# EAGLE design actuator_board (EAGLE 9.6.2)
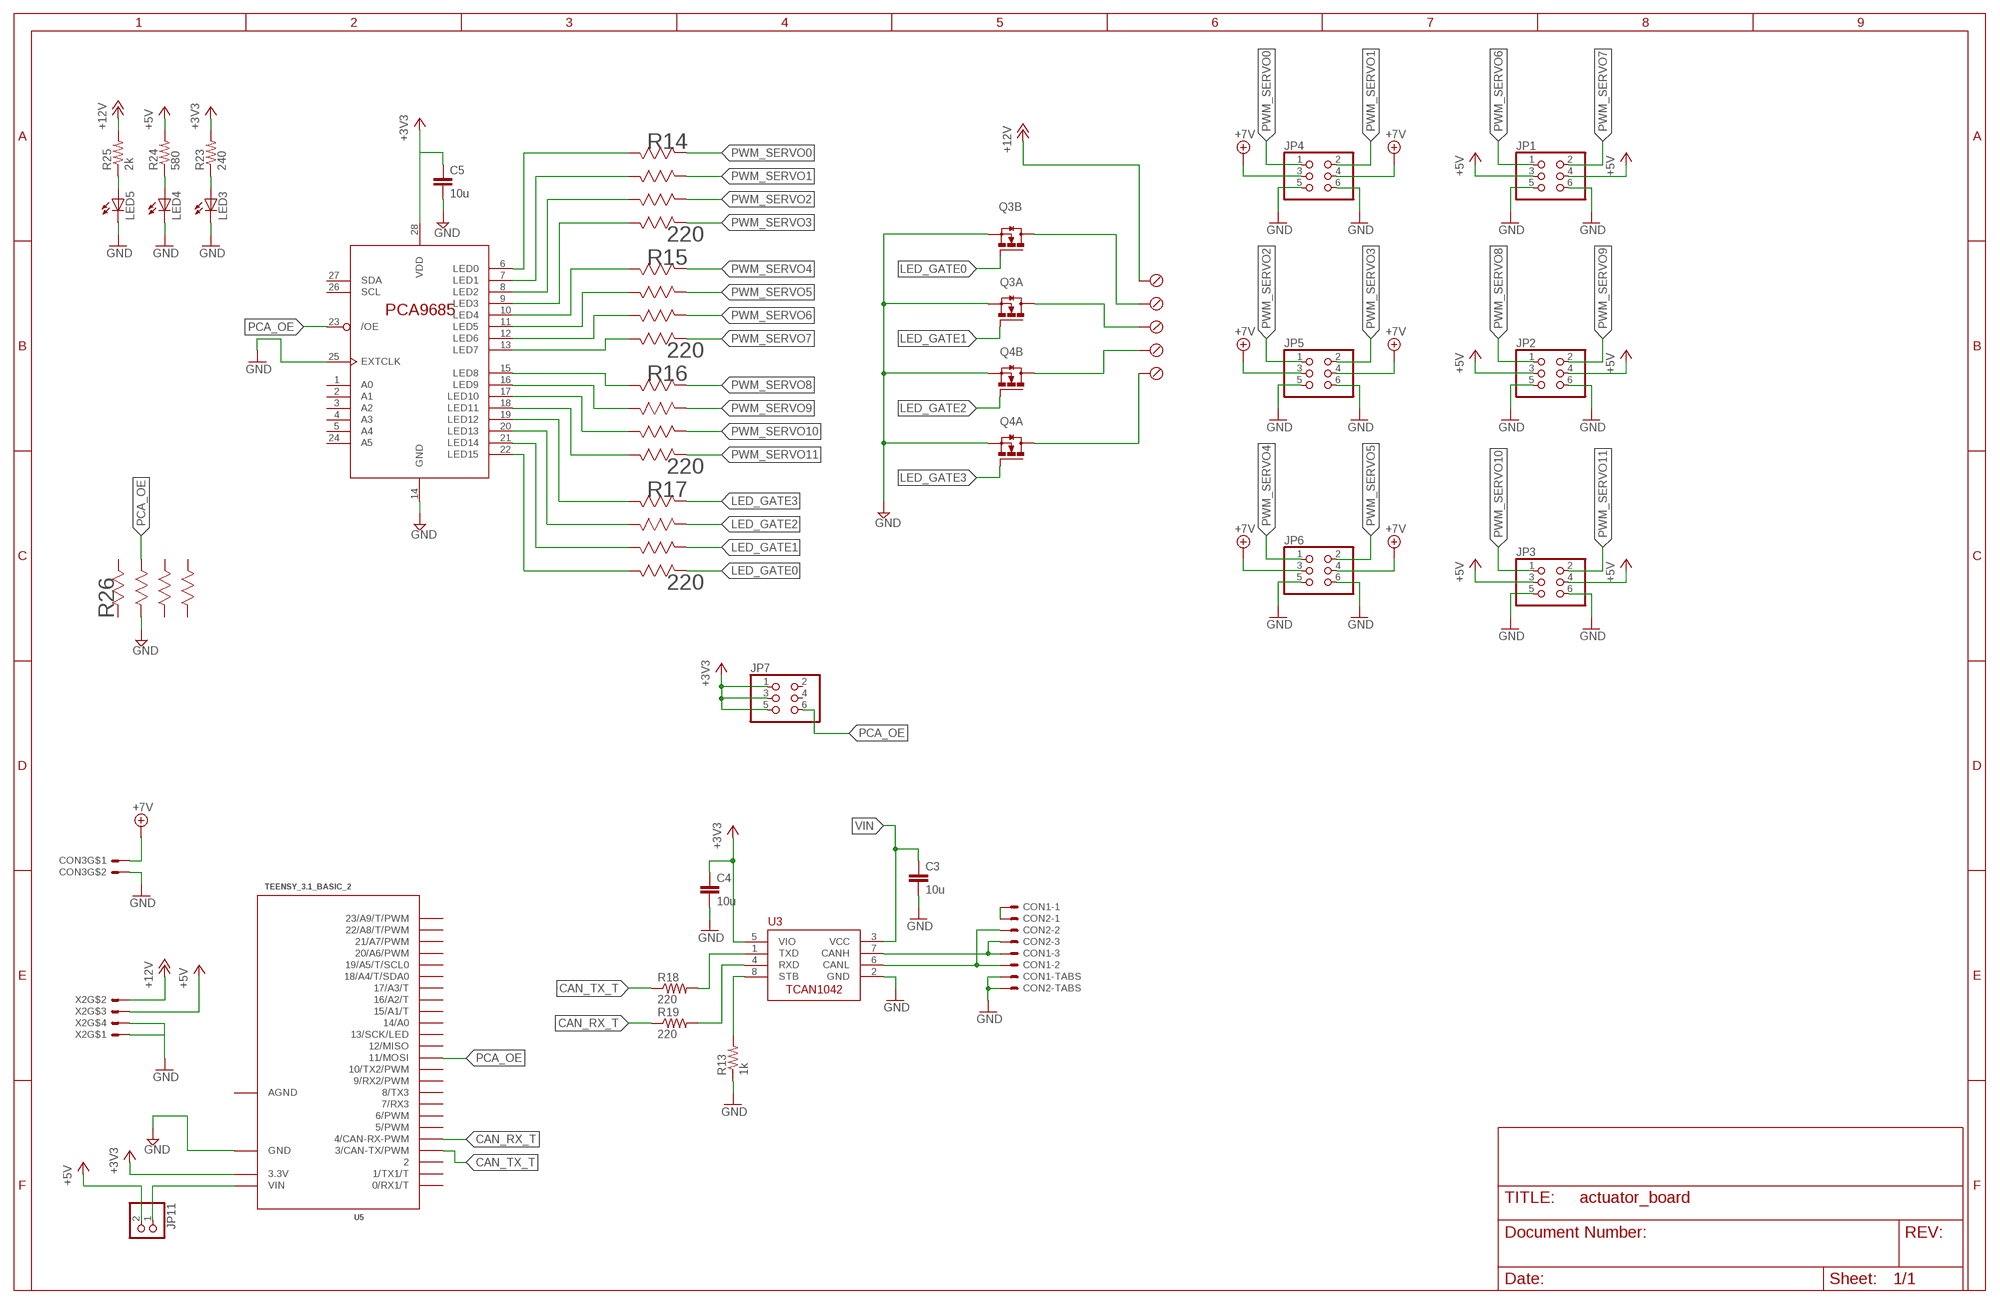
[diagram p0: schematic, sheet 1]

## Parts
C3  10u  C-EUC0805  [C0805]
C4  10u  C-EUC0805  [C0805]
C5  10u  C-EUC0805  [C0805]
CON1  SM03B-GHS-TB  [SM03B-GHS-TB]
CON2  SM03B-GHS-TB  [SM03B-GHS-TB]
CON3  MOLEX_5566-2  [5566-2]
JP1  PINHD-2X3  [2X03]
JP2  PINHD-2X3  [2X03]
JP3  PINHD-2X3  [2X03]
JP4  PINHD-2X3  [2X03]
JP5  PINHD-2X3  [2X03]
JP6  PINHD-2X3  [2X03]
JP7  PINHD-2X3  [2X03]
JP11  PINHD-1X2  [1X02]
LED3  LEDCHIPLED_1206  [CHIPLED_1206]
LED4  LEDCHIPLED_1206  [CHIPLED_1206]
LED5  LEDCHIPLED_1206  [CHIPLED_1206]
Q3  IRL6372TRPBF  [SO-8]
Q4  IRL6372TRPBF  [SO-8]
R13  1k  R-US_R0805  [R0805]
R14  220  EXB-V8V221JVEXBV8V-M  [EXBV8V-M]
R15  220  EXB-V8V221JVEXBV8V-M  [EXBV8V-M]
R16  220  EXB-V8V221JVEXBV8V-M  [EXBV8V-M]
R17  220  EXB-V8V221JVEXBV8V-M  [EXBV8V-M]
R18  220  R-US_R0805  [R0805]
R19  220  R-US_R0805  [R0805]
R23  240  R-US_R1206  [R1206]
R24  580  R-US_R1206  [R1206]
R25  2k  R-US_R1206  [R1206]
R26  10k  EXB-V8V221JVEXBV8V-M  [EXBV8V-M]
U3  TCAN1042HVDR  [SO-8]
U4  PCA9685PW  [TSSOP28]
U5  TEENSY_3.1_BASIC_2  [TEENSY_3.1_BASIC_2]
U$1  SCREWLESS_TERMINAL_HEADERSCREWLESS_TERMINAL_HEADER  [1989777_TERMINALHEADER]
X2  MOLEX_5566-4  [5566-4]

## Nets
+3V3: C4.1 C5.1 JP7.1 JP7.3 JP7.5 R23.2 U3.5(VIO) U4.28(VDD) U5.3.3V
+5V: JP1.3 JP1.4 JP2.3 JP2.4 JP3.3 JP3.4 JP11.2 R24.2 X2.3
+7V: CON3.1 JP4.3 JP4.4 JP5.3 JP5.4 JP6.3 JP6.4
+12V: R25.2 U$1.P$5(12+) X2.2
CAN_RX: R19.2 U3.4(RXD)
CAN_RX_T: R19.1 U5.4(4/CAN-RX-PWM)
CAN_TX1: R18.2 U3.1(TXD)
CAN_TX_T: R18.1 U5.3(3/CAN-TX/PWM)
CANH: CON1.P$3 CON2.P$3 U3.7(CANH)
CANL: CON1.P$2 CON2.P$2 U3.6(CANL)
CANSH: CON1.P$1 CON2.P$1
GND [net1]: C3.2 C4.2 C5.2 CON1.P$4 CON1.P$5 CON2.P$4 CON2.P$5 CON3.2 JP1.5 JP1.6 JP2.5 JP2.6 JP3.5 JP3.6 JP4.5 JP4.6 JP5.5 JP5.6 JP6.5 JP6.6 LED3.C LED4.C LED5.C Q3.1(B:S) Q3.3(A:S) Q4.1(B:S) Q4.3(A:S) R13.1 R26.2 U3.2(GND) U4.14(GND) U4.25(EXTCLK) U5.GND X2.1 X2.4
LED_DRAIN0: Q3.7(B:D) Q3.8(B:D) U$1.P$4(LED0)
LED_DRAIN1: Q3.5(A:D) Q3.6(A:D) U$1.P$3(LED1)
LED_DRAIN2: Q4.7(B:D) Q4.8(B:D) U$1.P$2(LED2)
LED_DRAIN3: Q4.5(A:D) Q4.6(A:D) U$1.P$1(LED3)
LED_GATE0: Q3.2(B:G) R17.4
LED_GATE1: Q3.4(A:G) R17.3
LED_GATE2: Q4.2(B:G) R17.2
LED_GATE3: Q4.4(A:G) R17.1
N$3: LED3.A R23.1
N$4: LED4.A R24.1
N$5: LED5.A R25.1
PCA_OE: JP7.6 R26.7 U4.23(/OE) U5.11(11/MOSI)
PWM_CH0: R14.8 U4.6(LED0)
PWM_CH1: R14.7 U4.7(LED1)
PWM_CH2: R14.6 U4.8(LED2)
PWM_CH3: R14.5 U4.9(LED3)
PWM_CH4: R15.8 U4.10(LED4)
PWM_CH5: R15.7 U4.11(LED5)
PWM_CH6: R15.6 U4.12(LED6)
PWM_CH7: R15.5 U4.13(LED7)
PWM_CH8: R16.8 U4.15(LED8)
PWM_CH9: R16.7 U4.16(LED9)
PWM_CH10: R16.6 U4.17(LED10)
PWM_CH11: R16.5 U4.18(LED11)
PWM_CH12: R17.8 U4.19(LED12)
PWM_CH13: R17.7 U4.20(LED13)
PWM_CH14: R17.6 U4.21(LED14)
PWM_CH15: R17.5 U4.22(LED15)
PWM_SERVO0: JP4.1 R14.1
PWM_SERVO1: JP4.2 R14.2
PWM_SERVO2: JP5.1 R14.3
PWM_SERVO3: JP5.2 R14.4
PWM_SERVO4: JP6.1 R15.1
PWM_SERVO5: JP6.2 R15.2
PWM_SERVO6: JP1.1 R15.3
PWM_SERVO7: JP1.2 R15.4
PWM_SERVO8: JP2.1 R16.1
PWM_SERVO9: JP2.2 R16.2
PWM_SERVO10: JP3.1 R16.3
PWM_SERVO11: JP3.2 R16.4
STB: R13.2 U3.8(STB)
VIN: C3.1 JP11.1 U3.3(VCC) U5.VIN
Unconnected: JP7.2 JP7.4 R26.1 R26.3 R26.4 R26.5 R26.6 R26.8 U4.1(A0) U4.2(A1) U4.3(A2) U4.4(A3) U4.5(A4) U4.24(A5) U4.26(SCL) U4.27(SDA) U5.0(0/RX1/T) U5.1(1/TX1/T) U5.2 U5.5(5/PWM) U5.6(6/PWM) U5.7(7/RX3) U5.8(8/TX3) U5.9(9/RX2/PWM) U5.10(10/TX2/PWM) U5.12(12/MISO) U5.13(13/SCK/LED) U5.14/A0 U5.15/A1(15/A1/T) U5.16/A2(16/A2/T) U5.17/A3(17/A3/T) U5.18/A4(18/A4/T/SDA0) U5.19/A5(19/A5/T/SCL0) U5.20/A6(20/A6/PWM) U5.21/A7(21/A7/PWM) U5.22/A8(22/A8/T/PWM) U5.23/A9(23/A9/T/PWM)

## Power pins joined to a net without a drawn wire
AGND: U5.AGND

## Library data of the parts
C3-C5 = rcl:C-EU: CAPACITOR, European symbol
CON1 CON2 = ARVP:SM03B-GHS-TB
CON3 = ARVP:MOLEX_5566-2
JP1-JP7 = pinhead:PINHD-2X3: PIN HEADER
JP11 = pinhead:PINHD-1X2: PIN HEADER
LED3-LED5 = led:LED: LED OSRAM: - CHIPLED LG R971, LG N971, LY N971, LG Q971, LY Q971, LO R971, LY R971 LH N974, LH R974 LS Q976, LO Q976, LY Q976 LO Q996 - Hyper CHIPLED LW Q18S LB Q993, LB Q99A, LB R99A - SideLED LS A670, LO A670, LY A670, LG A670, LP A670 LB A673, LV A673, LT A673, LW A673 LH A674 LY A675 LS A676, LA A676, LO A676, LY A676, LW A676 LS A679, LY A679, LG A679 - Hyper Micro SIDELED® LS Y876, LA Y876, LO Y876, LY Y876 LT Y87S - SmartLED LW L88C, LW L88S LB L89C, LB L89S, LG L890 LS L89K, LO L89K, LY L89K LS L896, LA L896, LO L896, LY L896 - TOPLED LS T670, LO T670, LY T670, LG T670, LP T670 LSG T670, LSP T670, LSY T670, LOP T670, LYG T670 LG T671, LOG T671, LSG T671 LB T673, LV T673, LT T673, LW T673 LH T674 LS T676, LA T676, LO T676, LY T676, LB T676, LH T676, LSB T676, LW T676 LB T67C, LV T67C, LT T67C, LS T67K, LO T67K, LY T67K, LW E67C LS E67B, LA E67B, LO E67B, LY E67B, LB E67C, LV E67C, LT E67C LW T67C LS T679, LY T679, LG T679 LS T770, LO T770, LY T770, LG T770, LP T770 LB T773, LV T773, LT T773, LW T773 LH T774 LS E675, LA E675, LY E675, LS T675 LS T776, LA T776, LO T776, LY T776, LB T776 LHGB T686 LT T68C, LB T68C - Hyper Mini TOPLED® LB M676 - Mini TOPLED Santana® LG M470 LS M47K, LO M47K, LY M47K Source: http://www.osram.convergy.de LUXEON: - LUMILED® LXK2-PW12-R00, LXK2-PW12-S00, LXK2-PW14-U00, LXK2-PW14-V00 LXK2-PM12-R00, LXK2-PM12-S00, LXK2-PM14-U00 LXK2-PE12-Q00, LXK2-PE12-R00, LXK2-PE12-S00, LXK2-PE14-T00, LXK2-PE14-U00 LXK2-PB12-K00, LXK2-PB12-L00, LXK2-PB12-M00, LXK2-PB14-N00, LXK2-PB14-P00, LXK2-PB14-Q00 LXK2-PR12-L00, LXK2-PR12-M00, LXK2-PR14-Q00, LXK2-PR14-R00 LXK2-PD12-Q00, LXK2-PD12-R00, LXK2-PD12-S00 LXK2-PH12-R00, LXK2-PH12-S00 LXK2-PL12-P00, LXK2-PL12-Q00, LXK2-PL12-R00 Source: www.luxeon.com KINGBRIGHT: KA-3528ASYC Source: www.kingbright.com
Q3 Q4 = dropper_torpedo_v3:IRL6372TRPBF
R13 R18 R19 R23-R25 = rcl:R-US_: RESISTOR, American symbol
R14-R17 R26 = ARVP:EXB-V8V221JV; MANUFACTURER_PART_NUMBER: EXBV8V221JV; VENDOR: Panasonic
U3 = ARVP:TCAN1042HVDR
U4 = dropper_torpedo_v3:PCA9685
U5 = Teensy_3_Series_Board_v1.0:TEENSY_3.1_BASIC_2: Footprint for Teensy 3.1 board using all pin connections on the outer perimeter
U$1 = Screwless-terminal-header:SCREWLESS_TERMINAL_HEADER
X2 = ARVP:MOLEX_5566-4

## Net classes
1 net1: clearance 0.203 mm to class 0

## Board
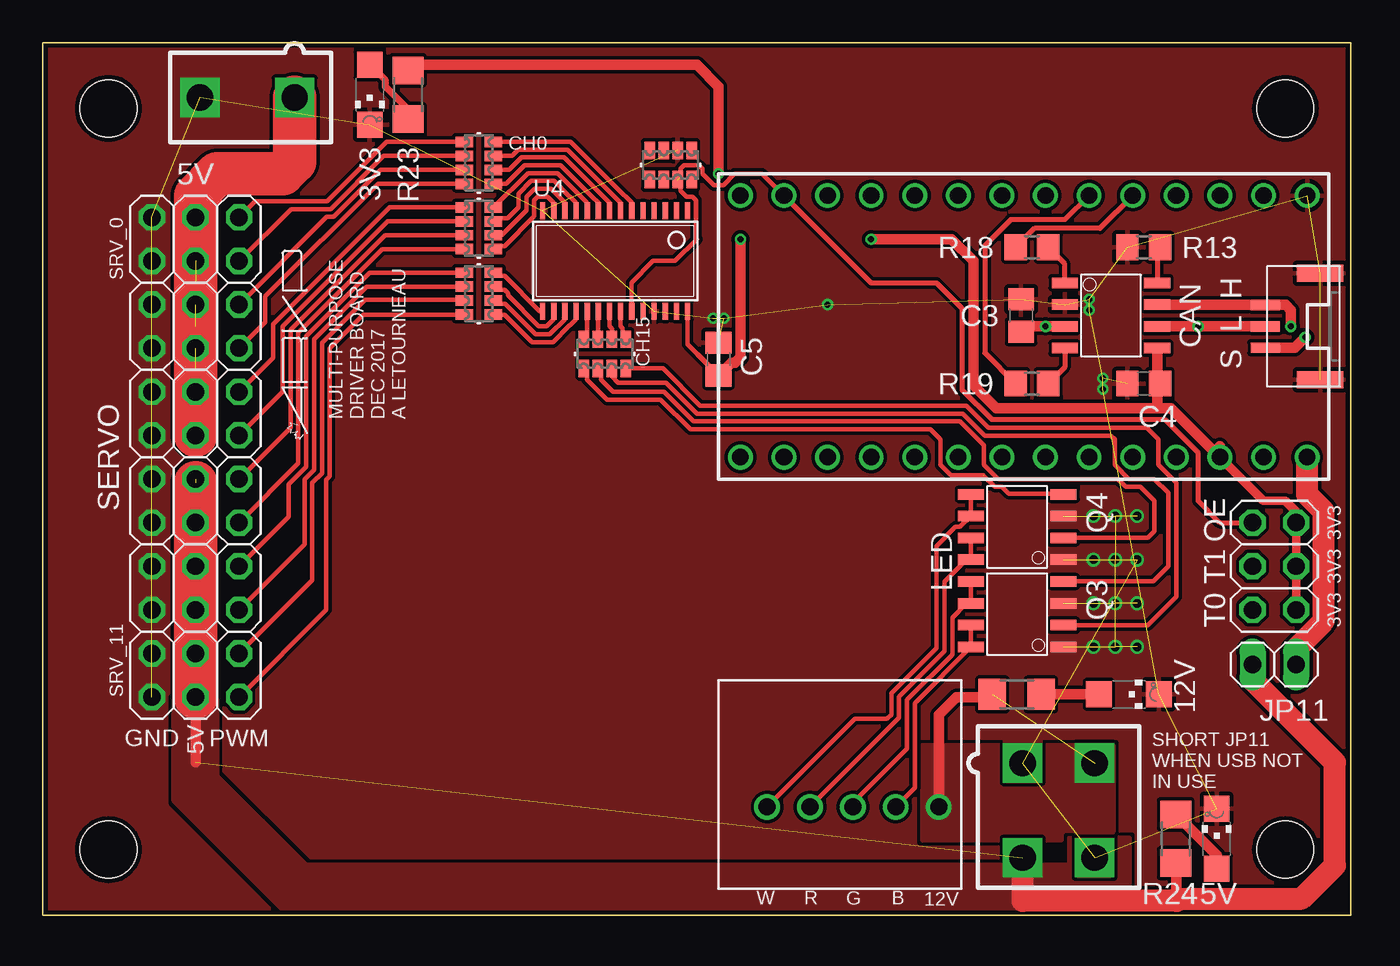
[diagram p1: board, top side]
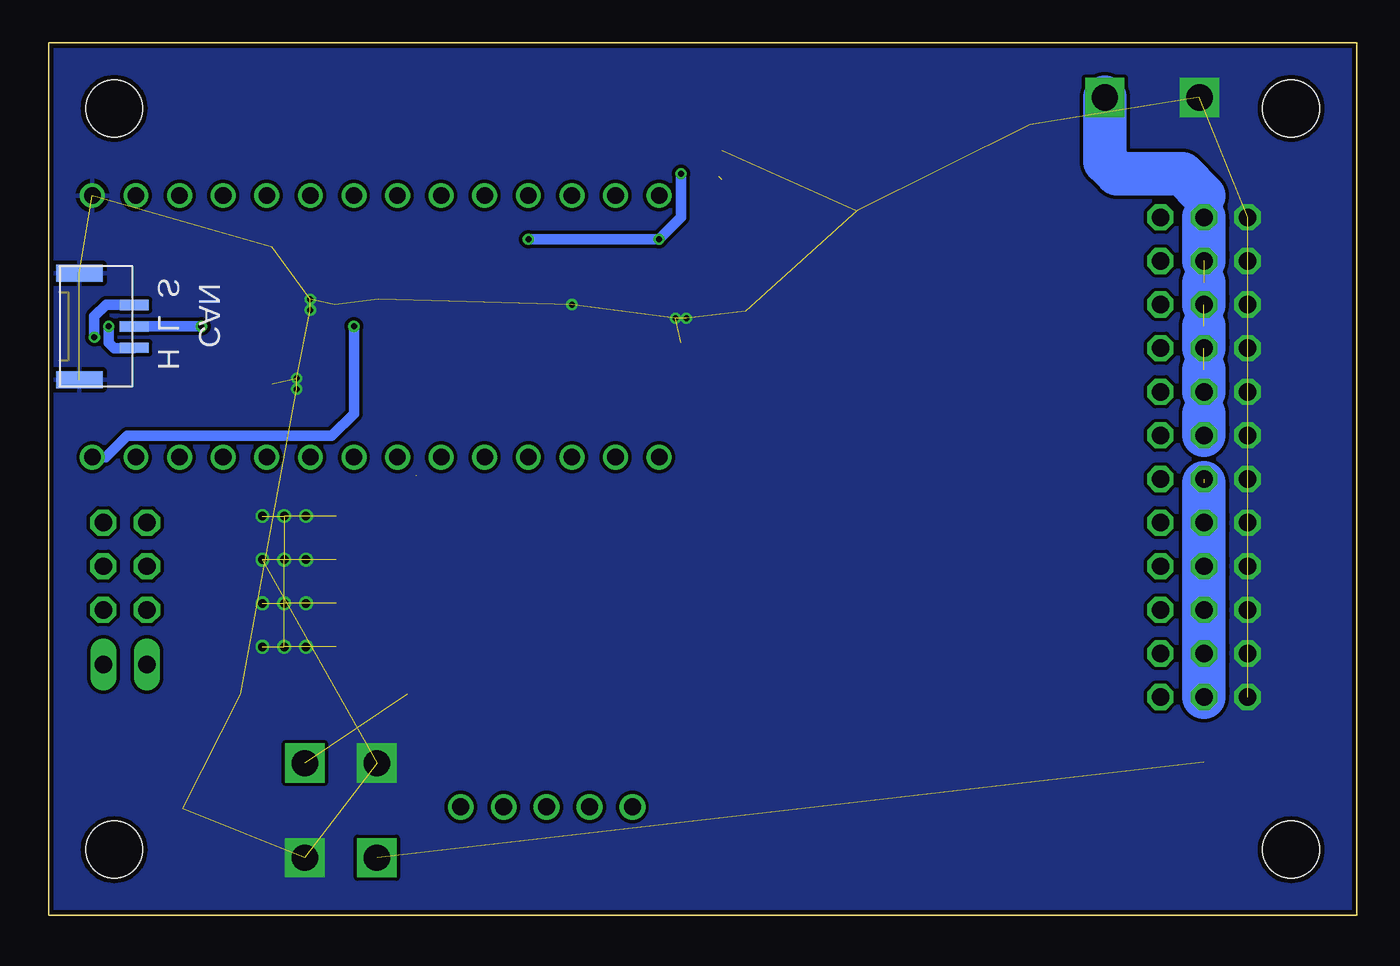
[diagram p2: board, bottom side, seen from below]

Size 76.2 x 50.8 mm. Coordinates in mm from the lower left corner, seen from the top.
Outline: 0,0 76.2,0 76.2,50.8 0,50.8 0,0
Copper layers (1*16): Top 0.035mm / dielectric 1.5mm / Bottom 0.035mm
Design rules "ITEADstudioDRC": minimum track width 6mil, minimum drill 12mil, track to track 8mil, track to pad 8mil, pad to pad 8mil, via to via 8mil, smd to smd 0mil, copper to edge 10mil, drill to drill 10mil, minimum pad ring 6mil, minimum via ring 6mil, stop-mask expansion 2mil, vias tented up to drill 100mil, thermal gap 10mil
Milling: 4 lines

### Footprints (pad centres in the part's own frame; a part is rotated, then mirrored left to right if it is on the bottom)
C0805 = smd 1.3 x 1.5: 1 -0.95,0; 2 0.95,0
SM03B-GHS-TB = smd 0.6 x 1.7: P$1 -1.25,0.85; P$2 0,0.85; P$3 1.25,0.85 | smd 1 x 2.7: P$4 -3.1,-2.35; P$5 3.1,-2.35
5566-2 = drill 1.524 square: 1 0,-2.756; 2 0,2.756
2X03 = drill 1.016 octagon: 1 -2.54,-1.27; 2 -2.54,1.27; 3 0,-1.27; 4 0,1.27; 5 2.54,-1.27; 6 2.54,1.27
1X02 = drill 1.016 long: 1 -1.27,0; 2 1.27,0
CHIPLED_1206 = smd 1.5 x 1.5: A 0,-1.75; C 0,1.75
SO-8 = smd 1.524 x 0.61: 1 -2.692,1.905; 2 -2.692,0.635; 3 -2.692,-0.635; 4 -2.692,-1.905; 5 2.692,-1.905; 6 2.692,-0.635; 7 2.692,0.635; 8 2.692,1.905
R0805 = smd 1.3 x 1.5: 1 -0.95,0; 2 0.95,0
EXBV8V-M = smd 1.016 x 0.61: 1 -0.851,1.219; 2 -0.851,0.406; 3 -0.851,-0.406; 4 -0.851,-1.219; 5 0.851,-1.219; 6 0.851,-0.406; 7 0.851,0.406; 8 0.851,1.219
R1206 = smd 1.6 x 1.803: 1 -1.422,0; 2 1.422,0
TSSOP28 = smd 0.305 x 0.991: 1 -4.225,-2.918; 2 -3.575,-2.918; 3 -2.925,-2.918; 4 -2.275,-2.918; 5 -1.625,-2.918; 6 -0.975,-2.918; 7 -0.325,-2.918; 8 0.325,-2.918; 9 0.975,-2.918; 10 1.625,-2.918; 11 2.275,-2.918; 12 2.925,-2.918; 13 3.575,-2.918; 14 4.225,-2.918; 15 4.225,2.918; 16 3.575,2.918; 17 2.925,2.918; 18 2.275,2.918; 19 1.625,2.918; 20 0.975,2.918; 21 0.325,2.918; 22 -0.325,2.918; 23 -0.975,2.918; 24 -1.625,2.918; 25 -2.275,2.918; 26 -2.925,2.918; 27 -3.575,2.918; 28 -4.225,2.918
TEENSY_3.1_BASIC_2 = drill 0.965: 0 -7.62,13.97; 1 -7.62,11.43; 2 -7.62,8.89; 3 -7.62,6.35; 3.3V 7.62,11.43; 4 -7.62,3.81; 5 -7.62,1.27; 6 -7.62,-1.27; 7 -7.62,-3.81; 8 -7.62,-6.35; 9 -7.62,-8.89; 10 -7.62,-11.43; 11 -7.62,-13.97; 12 -7.62,-16.51; 13 7.62,-16.51; 14/A0 7.62,-13.97; 15/A1 7.62,-11.43; 16/A2 7.62,-8.89; 17/A3 7.62,-6.35; 18/A4 7.62,-3.81; 19/A5 7.62,-1.27; 20/A6 7.62,1.27; 21/A7 7.62,3.81; 22/A8 7.62,6.35; 23/A9 7.62,8.89; AGND 7.62,13.97; GND -7.62,16.51; VIN 7.62,16.51
1989777_TERMINALHEADER = drill 0.991 pad 1.499: P$1 2.825,4.775; P$2 5.325,4.775; P$3 7.825,4.775; P$4 10.325,4.775; P$5 12.825,4.775
STAND-OFF = hole 3.302: 0,0
5566-4 = drill 1.524 square: 1 2.101,-2.756; 2 -2.101,-2.756; 3 2.101,2.756; 4 -2.101,2.756

### Placement (x,y rotation side)
C3  56.99,34.92 90 top
C4  64.14,30.96 180 top
C5  39.37,32.38 90 top
CON1  72.07,34.29 90 top
CON2  72.07,34.29 270 bottom
CON3  11.91,47.62 90 top
JP1  8.89,24.13 180 top
JP2  8.89,19.05 180 top
JP3  8.89,13.97 180 top
JP4  8.89,39.37 180 top
JP5  8.89,34.29 180 top
JP6  8.89,29.21 180 top
JP7  71.75,20.32 90 top
JP11  71.75,14.61 180 top
LED3  19.05,47.78 180 top
LED4  68.39,4.45 0 top
LED5  63.28,12.86 270 top
Q3  56.77,17.53 180 top
Q4  56.77,22.61 180 top
R13  64.14,38.89 0 top
R14  25.4,43.81 0 top
R15  25.4,40.01 0 top
R16  25.4,36.2 0 top
R17  32.74,32.69 90 top
R18  57.63,38.89 0 top
R19  57.63,30.96 0 top
R23  21.27,47.78 90 top
R24  66.01,4.45 270 top
R25  56.74,12.86 180 top
R26  36.58,43.69 270 top
U3  62.23,34.92 0 top
U4  33.34,38.1 180 top
U5  57.15,34.29 270 top
U$1  39.37,1.52 0 top
U$5  [LOGO3]  15.37,27.84 90 top
U$6  [LETTER_L]  -82.55,-72.39 0 top  (outside the outline)
U$7  [DOCFIELD]  64.77,-72.39 0 top  (outside the outline)
U$8  [STAND-OFF]  72.39,3.81 0 top
U$9  [STAND-OFF]  3.81,3.81 0 top
U$10  [STAND-OFF]  3.81,46.99 0 top
U$11  [STAND-OFF]  72.39,46.99 0 top
X2  59.18,6.1 180 top

### Tracks (layer width: path | path; a pad name or v marks a point on that pad's centre or on a via)
+3V3  (via drill 0.35)
  Top 0.152: R23.2 21.59,49.53 21.6,49.53
  Top 0.254: 38.16,32.64 37.56,33.24 U4.28
  Top 0.305: C5.1 38.16,32.64
  Top 0.508: U5.3.3V 71.12,24.13 72.39,24.13 73.03,23.5 JP7.5 JP7.3 JP7.1
  Top 0.61: 64.92,31.12 U3.5 | 64.92,31.12 C4.1 64.93,30.8 64.93,29.53 | 64.92,30.96 64.92,31.12 | 68.58,27.3 U5.3.3V 65.72,29.53 64.93,29.53 | C5.1 40.11,32.18 40.33,32.18 40.64,32.49 v40.64,39.37 | v39.37,43.18 39.37,48.26 38.1,49.53 36.83,49.53 21.59,49.53 | v48.26,39.37 52.95,39.37 54.22,38.1 54.22,30.87 55.56,29.53 64.93,29.53
  Bottom 0.61: v39.37,43.18 39.37,40.64 v40.64,39.37 v48.26,39.37
+5V  (2 unrouted)
  Top 0.152: 8.89,24.13 JP1.4 8.89,26.39
  Top 0.61: JP3.4 8.89,8.89 | R24.2 66.04,2.99 66.04,0.95 66.04,0.83
  Top 1.27: X2.3 57.08,0.83 66.04,0.83 | 66.04,0.95 73.34,0.95 75.27,2.88 75.27,8.89 70.48,13.68 JP11.2
  Top 2.54: JP3.4 JP3.3 JP2.4 JP2.3 JP1.4 8.89,25.2
  Bottom 2.54: JP3.3 8.89,16.51 | JP3.3 JP2.4 JP2.3 JP1.4 8.89,25.2 | 8.89,13.97 JP3.4 JP3.3
  pour Top (no thermals): 59.82,4.51 59.82,2.92 15.34,2.92 10.16,8.1 10.16,12.54 10,12.7 7.78,12.7 7.62,12.54 7.62,6.67 13.97,0.32 63.31,0.32 63.31,4.51
+7V  (3 unrouted)
  Top 0.152: 8.89,26.95 JP6.4
  Top 2.54: CON3.1 14.66,43.87 13.97,43.18 10.16,43.18 8.89,41.91 JP4.3 JP6.4
  Bottom 2.54: JP5.3 8.89,36.83 | JP5.4 8.89,34.29 | JP6.4 8.89,29.21 | JP6.3 8.89,31.75 | 8.89,41.91 10.16,43.18 13.97,43.18 14.61,43.81 | 14.61,43.81 14.61,44.13 | 14.61,43.81 14.66,43.87 CON3.1 | JP4.4 JP4.3
+12V  (1 unrouted)
  Top 0.61: R25.2 55.16,12.7 53.21,12.7 52.2,11.68 U$1.P$5
  pour Top (rank 2, no thermals): 62.36,9.91 62.36,4.83 59.34,4.83 59.34,4.35 51.24,4.35 51.24,9.91
CAN_RX
  Top 0.305: U3.4 59.54,31.92 R19.2
CAN_RX_T
  Top 0.305: U5.4 59.56,40.51 56.39,40.51 54.88,39 54.88,32.75 R19.1
CAN_TX1
  Top 0.305: U3.1 59.54,37.93 R18.2
CAN_TX_T
  Top 0.305: U5.3 61.59,40 57.78,40 57.57,39.79 R18.1
CANH  (via drill 0.35)
  Top 0.61: U3.7 71.2,35.56 CON1.P$3 72.41,35.54 72.71,35.24 v72.71,34.29
  Bottom 0.61: v72.71,34.29 72.71,33.34 72.39,33.02 71.24,33.02 CON2.P$3
CANL  (via drill 0.35)
  Top 0.61: U3.6 v67.31,34.29 CON2.P$2
  Bottom 0.61: CON2.P$2 v67.31,34.29
CANSH  (via drill 0.35)
  Top 0.61: CON1.P$1 72.93,33.04 v73.54,33.66
  Bottom 0.61: v73.54,33.66 73.54,34.88 72.87,35.56 71.24,35.56 CON2.P$1
GND  (via drill 0.35, 0.5)  (53 unrouted)
  other vias: 62.48,23.24 61.21,23.24 62.48,20.7 61.21,20.7 62.48,18.16 61.21,18.16 62.48,15.62 61.21,15.62 63.75,23.24 63.75,20.7 63.75,18.16 63.75,15.62 61.75,31.27 61.75,30.64 60.96,35.88 60.96,35.24 39.05,34.77 39.69,34.77 45.72,35.56
  pour Bottom (rank 3, no thermals): 55.69,10.38 55.69,1.81 62.67,1.81 62.67,10.38
  pour Top (no thermals): 58.52,23.88 64.39,23.88 64.39,22.61 58.52,22.61
  pour Top (no thermals): 58.36,21.34 64.39,21.34 64.39,20.07 58.36,20.07
  pour Top (no thermals): 58.52,18.8 64.39,18.8 64.39,17.53 58.52,17.53
  pour Top (no thermals): 58.52,16.26 64.39,16.26 64.39,14.99 58.52,14.99
  pour Bottom (no thermals): 5.08,41.91 7.62,41.91 7.62,11.43 5.08,11.43
  pour Top (rank 3, no thermals): 55.53,10.38 55.53,1.49 62.04,1.46 62.67,10.38
  pour Top (rank 2, no thermals): 5.08,41.91 7.62,41.91 7.62,11.43 5.08,11.43
  pour Top (no thermals): 11.27,46.2 11.27,49.05 7.14,49.05 7.14,46.2
  pour Bottom (no thermals): 11.27,46.2 11.27,49.05 7.14,49.05 7.14,46.2
  pour Bottom (rank 2): 0.32,0.32 75.88,0.32 75.88,50.48 0.32,50.48
  pour Top (rank 3): 0.32,0.32 75.88,0.32 75.88,50.48 0.32,50.48
LED_DRAIN0
  Top 0.254: Q3.7 Q3.8 50.8,12.34 50.8,7.4 U$1.P$4
LED_DRAIN1
  Top 0.254: Q3.5 Q3.6 53.81,18.16 52.98,17.33 52.98,15.18 50.34,12.53 50.34,9.7 47.2,6.55 U$1.P$3
LED_DRAIN2
  Top 0.254: Q4.7 Q4.8 53.81,20.7 52.53,19.41 52.53,15.37 49.89,12.72 49.89,11.49 U$1.P$2
LED_DRAIN3
  Top 0.254: Q4.5 Q4.6 53.44,22.61 53.18,22.61 52.07,21.5 52.07,15.55 49.43,12.91 49.43,11.68 49.18,11.43 47.33,11.43 U$1.P$1
LED_GATE0
  Top 0.254: R17.4 36.12,31.84 38.29,29.67 53.81,29.67 55.09,28.38 64.33,28.38 64.99,27.72 64.99,26.23 66.04,25.18 66.04,18.54 64.39,16.89 Q3.2
LED_GATE1
  Top 0.254: R17.3 33.15,31.37 33.52,31 36.31,31 38.1,29.21 53.62,29.21 54.9,27.93 62.23,27.93 62.45,27.71 62.45,26.23 63.28,25.4 64.77,25.4 65.58,24.59 65.58,20.32 64.69,19.43 Q3.4
LED_GATE2
  Top 0.254: R17.2 32.51,31.66 32.51,31.19 33.23,30.48 36.18,30.48 37.91,28.75 53.43,28.75 54.83,27.35 54.83,26.23 55.66,25.4 62.63,25.4 63.07,24.97 63.09,24.94 63.96,24.94 64.77,24.13 64.77,22.35 64.39,21.97 Q4.2
LED_GATE3  (1 unrouted)
  Top 0.254: Q4.4 59.54,24.59 59.59,24.54 56.29,24.54 55.88,24.94 55.47,24.94 54.81,25.6 | R17.1 31.7,31.66 31.7,31.19 32.87,30.02 35.99,30.02 37.72,28.3 51.71,28.3 52.29,27.72 52.29,26.23 52.9,25.62 54.8,25.62
N$3
  Top 0.406: LED3.A 19.96,48.62 19.96,48.24 21.27,46.93 R23.1
N$4
  Top 0.61: R24.1 68.39,3.49 LED4.A
N$5
  Top 0.61: R25.1 LED5.A
PCA_OE  (1 unrouted)
  Top 0.152: 39.37,42.52 39.32,42.57 39.12,42.57
  Top 0.254: U5.11 41.91,43.18 40.3,43.18 39.64,42.52 39.37,42.52 39.1,42.52 38.43,43.19 38.43,43.48 38.24,43.67 37.35,43.67 37.16,43.48 37.16,43.02 | U4.23 34.29,35.2 34.29,36.83 35.56,38.1 36.83,38.1 38.1,39.37 38.05,39.42 38.05,41.65 37.85,41.84 37.51,41.84 37.16,42.19 37.16,42.66 R26.7
  Top 0.305: U5.11 48.26,36.83 52.07,36.83 53.34,35.56 53.56,35.34 53.56,30.6 55.29,28.87 65.37,28.87 67.31,26.93 67.31,24.13 68.58,22.86 JP7.6
PWM_CH0
  Top 0.254: R14.8 27.49,45.03 27.5,45.04 30.74,45.04 33.49,42.3 34.31,41.48 U4.6
PWM_CH1
  Top 0.254: R14.7 27.32,44.22 27.69,44.59 30.55,44.59 33.3,41.84 33.66,41.48 U4.7
PWM_CH2
  Top 0.254: R14.6 27.16,43.41 27.88,44.13 30.36,44.13 32.19,42.3 33.01,41.48 U4.8
PWM_CH3
  Top 0.254: R14.5 26.99,42.6 28.07,43.67 30.17,43.67 32,41.84 32.36,41.48 U4.9
PWM_CH4
  Top 0.254: R15.8 26.26,41.22 28.25,43.22 29.97,43.22 30.89,42.3 31.71,41.48 U4.10
PWM_CH5
  Top 0.254: R15.7 26.43,40.59 27.06,40.59 27.71,41.24 27.71,42.03 28.45,42.76 29.78,42.76 30.7,41.84 31.06,41.48 U4.11
PWM_CH6
  Top 0.254: R15.6 26.72,39.6 28.17,41.05 28.17,41.84 28.63,42.3 29.59,42.3 30.41,41.48 U4.12
PWM_CH7
  Top 0.254: R15.5 26.43,38.96 26.9,38.96 28.63,40.7 28.63,41.65 28.82,41.84 29.4,41.84 29.76,41.48 U4.13
PWM_CH8
  Top 0.254: R16.8 26.43,37.24 26.9,37.24 28.95,35.18 U4.15
PWM_CH9
  Top 0.254: R16.7 26.43,36.42 26.9,36.42 27.09,36.23 27.09,36.09 28.89,34.29 29.34,34.29 29.76,34.72 U4.16
PWM_CH10
  Top 0.254: R16.6 26.43,35.61 26.92,35.61 28.7,33.83 29.53,33.83 30.41,34.72 U4.17
PWM_CH11
  Top 0.254: R16.5 26.91,34.98 28.51,33.38 29.72,33.38 30.7,34.36 31.06,34.72 U4.18
PWM_CH12
  Top 0.254: U4.19 31.71,34.2 31.7,34.19 31.7,33.72 R17.8
PWM_CH13
  Top 0.254: R17.7 32.33,35.15 U4.20
PWM_CH14
  Top 0.254: R17.6 33.15,34.16 33.01,34.3 U4.21
PWM_CH15
  Top 0.254: U4.22 33.66,34.3 33.78,34.19 33.78,33.72 R17.5
PWM_SERVO0
  Top 0.254: 24.37,44.86 R14.1 20.02,45.03 16.56,41.58 12.37,41.58 JP4.1
PWM_SERVO1
  Top 0.254: JP4.2 14.45,41.12 16.75,41.12 19.85,44.22 R14.2
PWM_SERVO2
  Top 0.254: 24.42,43.54 R14.3 19.68,43.41 16.94,40.66 16.54,40.66 JP5.1
PWM_SERVO3
  Top 0.254: JP5.2 12.95,34.54 12.95,36.03 19.52,42.6 R14.4
PWM_SERVO4
  Top 0.254: JP6.1 13.41,32.46 13.41,34.42 20.21,41.22 R15.1
PWM_SERVO5
  Top 0.254: JP6.2 13.97,30.48 13.97,34.29 20.09,40.41 R15.2
PWM_SERVO6
  Top 0.254: 24.37,39.42 R15.3 19.93,39.6 14.43,34.1 14.43,28.4 JP1.1
PWM_SERVO7
  Top 0.254: R15.4 19.76,38.79 14.88,33.91 14.88,26.31 JP1.2
PWM_SERVO8
  Top 0.254: JP2.1 14.33,23.22 14.33,25.11 15.34,26.12 15.34,33.72 19.03,37.41 R16.1
PWM_SERVO9
  Top 0.254: R16.2 18.87,36.6 15.8,33.53 15.8,25.94 15.24,25.38 15.24,21.59 JP2.2
PWM_SERVO10
  Top 0.254: 24.37,35.61 R16.3 24.49,35.85 18.76,35.85 16.26,33.34 16.26,25.75 15.7,25.19 15.7,19.51 JP3.1
PWM_SERVO11
  Top 0.254: R16.4 18.67,34.98 16.71,33.02 16.71,25.56 16.51,25.35 16.51,17.78 JP3.2
STB
  Top 0.305: R13.2 64.92,38.73 U3.8
VIN  (via drill 0.35)
  Top 0.61: C3.1 57.15,34.29 v58.42,34.29 U3.3 59.69,34.29
  Top 1.27: JP11.1 73.03,15.52 74.62,17.12 74.62,23.52 73.66,24.49 U5.VIN
  Bottom 0.61: U5.VIN 72.88,26.67 71.64,27.91 59.72,27.91 58.42,29.21 v58.42,34.29

### Text on the board
tNames: 3V3 | CH0 | 5V | SRV_0 | H | CAN | L | CH15 | S | MULTI-PURPOSE / DRIVER BOARD / DEC 2017 / A LETOURNEAU | SERVO | OE | 3V3 | LED | T1 | 3V3 | T0 | 3V3 | SRV_11 | 12V | 5V | SHORT JP11 / WHEN USB NOT / IN USE | GND | PWM | W | R | G | B | 12V | 5V
bNames: S | CAN | L | H